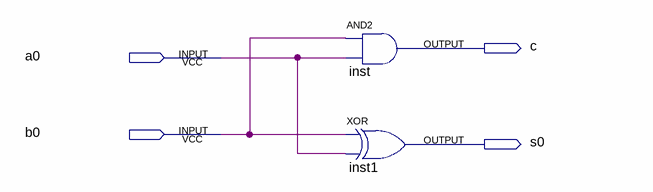
[diagram p0: schematic sheet]
// Quartus schematic QJQ.bdf as structural Verilog: 2 symbols, 4 pins
module QJQ (
  input  a0,
  input  b0,
  output c,
  output s0
);

  and inst (c, b0, a0);
  xor inst1 (s0, b0, a0);
endmodule
